# EasyEDA Pro project ProPrj_sensor_ultimate_2025-09-30.epro

# Schematic Schematic1
Board Name: Board1; Create Date: 2025-09-01; Page Name: P1; Project Name: sensor_ultimate; Schematic Name: Schematic1; Update Date: 2025-09-18; Company: EasyEDA.com; Page Size: A4; Version: V1.0
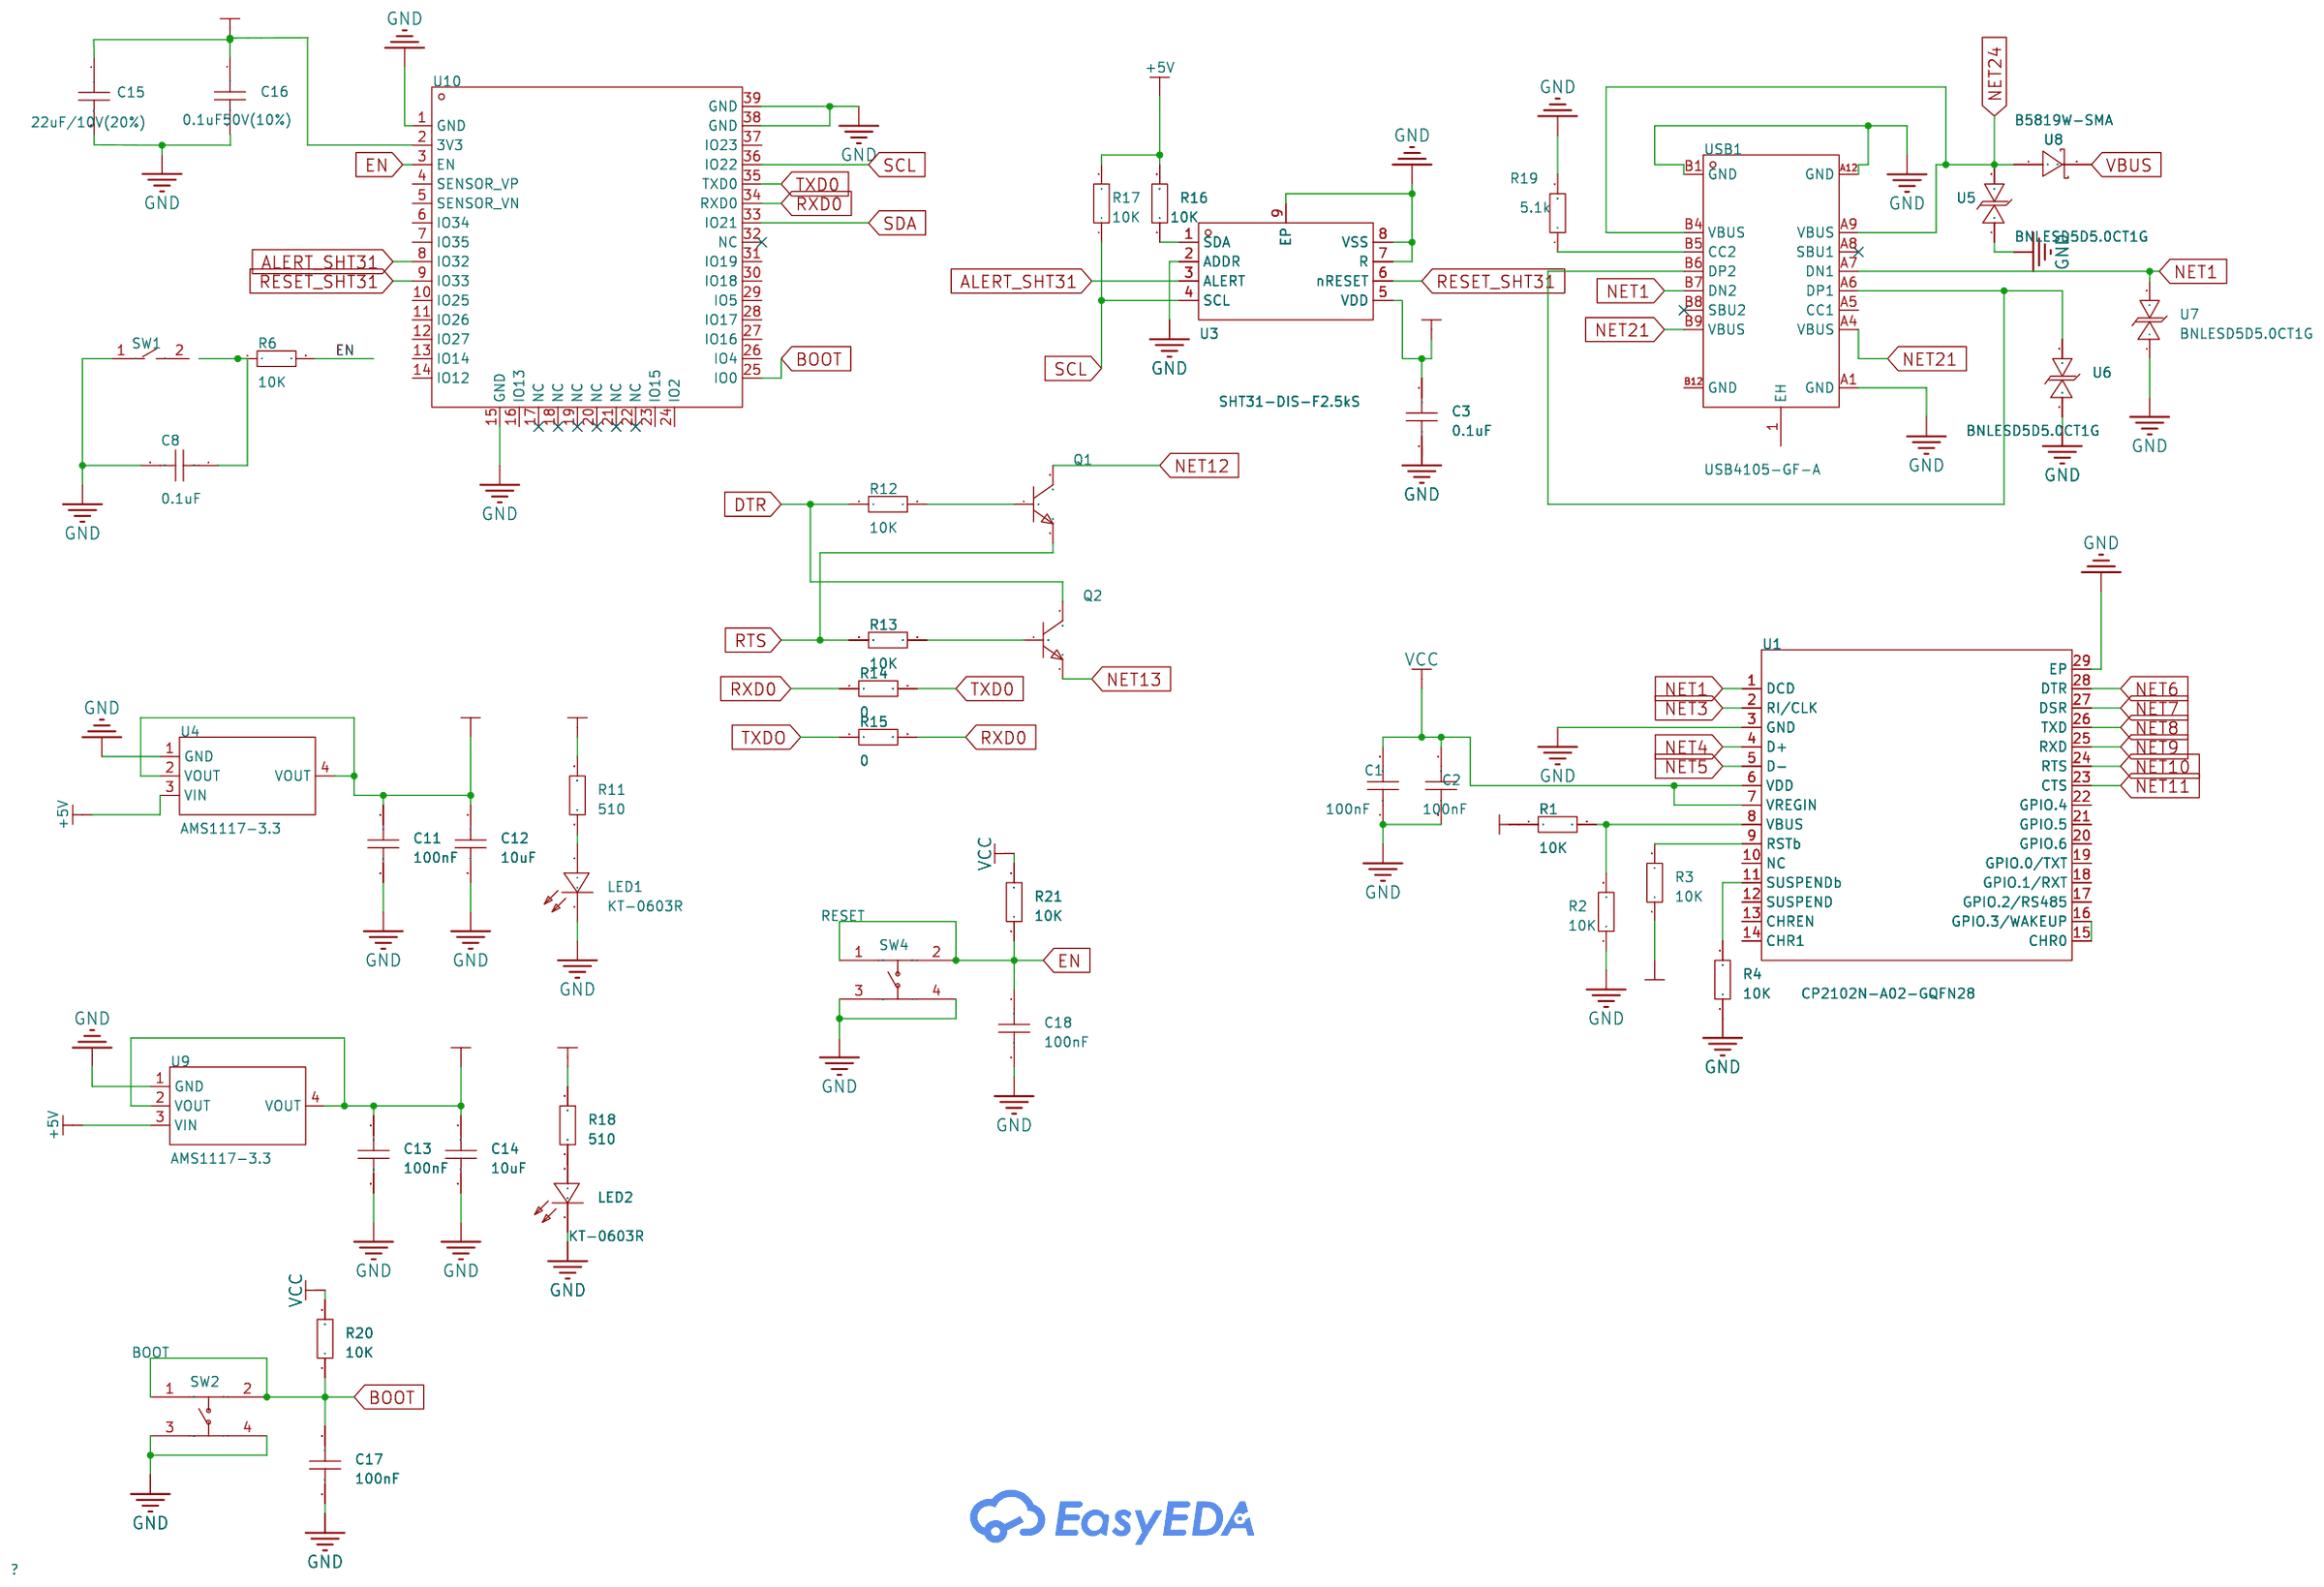
[diagram p0: schematic sheet]

## Parts
C1  100nF  [C0603]
C2  100nF  [C0603]
C3  0.1uF  [C0603]
C8  0.1uF  [C0201]
C11  100nF  [C0603]
C12  10uF  [C0603]
C13  100nF  [C0603]
C14  10uF  [C0603]
C15  22uF/10V(20%)  [C0201]
C16  0.1uF50V(10%)  [C0201]
C17  100nF  [C0603]
C18  100nF  [C0603]
LED1  KT-0603R  [LED0603-RD]
LED2  KT-0603R  [LED0603-RD]
Q1  -  [SOT-23_L2.9-W1.3-P1.90-LS2.4-BR]
Q2  -  [SOT-23_L2.9-W1.3-P1.90-LS2.4-BR]
R1  10K  [R0603]
R2  10K  [R0603]
R3  10K  [R0603]
R4  10K  [R0603]
R6  10K  [R0603]
R11  510  [R0603]
R12  10K  [R0603]
R13  10K  [R0603]
R14  0  [R0603]
R15  0  [R0603]
R16  10K  [R0603]
R17  10K  [R0603]
R18  510  [R0603]
R19  5.1k  [R0603]
R20  10K  [R0603]
R21  10K  [R0603]
SW1  TSE36331-025D343DF-R3000  [SW-SMD_L6.0-W3.7-TSE36331-025D343DF-R3000]
SW2  BOOT  [KEY-TH_4P-L6.0-W6.0-P4.50-LS6.5]
SW4  RESET  [KEY-TH_4P-L6.0-W6.0-P4.50-LS6.5]
U1  CP2102N-A02-GQFN28  [QFN-28_L5.0-W5.0-P0.50-TL-EP3.3]
U3  SHT31-DIS-F2.5kS  [DFN-8_L2.5-W2.5-P0.50-BL-EP]
U4  AMS1117-3.3  [SOT-223-3_L6.5-W3.4-P2.30-LS7.0-BR]
U5  BNLESD5D5.0CT1G  [SOD-523_L1.2-W0.8-LS1.6-BI]
U6  BNLESD5D5.0CT1G  [SOD-523_L1.2-W0.8-LS1.6-BI]
U7  BNLESD5D5.0CT1G  [SOD-523_L1.2-W0.8-LS1.6-BI]
U8  B5819W-SMA  [SOD-123_L2.7-W1.6-LS3.7-FD]
U9  AMS1117-3.3  [SOT-223-3_L6.5-W3.4-P2.30-LS7.0-BR]
U10  ESP32-WROOM-32E-H4  [WIFI-SMD_ESP32-WROOM-32E]
USB1  USB4105-GF-A  [TYPE-C-SMD_SBC-160S1A-20-S412]

## Library data of the parts
C1-C3 C11-C14 C17 C18 = CAP_0603: Supplier Footprint: 0603
C8 C15 C16 = CAP_0201: Supplier Footprint: 0201
LED1 LED2 = KT-0603R: Emitted Color:Red Power Dissipation:- Forward Current:- Dominant Wavelength:- Dominant Wavelength:- Peak Wavelength:- Diode Configuration:- Lens Color:- Color Temperature:- Color Temperature:- Viewing Angle:- Mounting Sytle:- Operating Temperature:-40℃~+8; LCSC Part Name: 0603 红灯 高亮; Supplier Part: C2286; Manufacturer: KENTO; Supplier Footprint: 0603; JLCPCB Part Class: Basic Part; Datasheet: https://atta.szlcsc.com/upload/public/pdf/source/20160616/1466072038404.pdf; Supplier: LCSC; Emitted Color: Red; Operating Temperature: -40℃~+85℃
Q1 Q2 = S8050_NPN: Supplier Footprint: SOT-23
R1-R4 R6 R11-R21 = Res_0603: Supplier Footprint: 0603
SW1 = TSE36331-025D343DF-R3000: LCSC Part Name: 3*6*2.5贴片防尘开关; Supplier Part: C48928354; Manufacturer: Khon(康宏电子); Supplier Footprint: SMD; JLCPCB Part Class: Extended Part; Datasheet: https://item.szlcsc.com/datasheet/TSE36331-025D343DF-R3000/51238608.html; Supplier: LCSC
SW2 SW4 = PTS645SH50-2LFS: Circuit:SPST Actuator Style:Round Button Operating Force:200gf Mounting Type:Direct Insert Length:6mm Width:6mm Switch Height:0.85mm Contact Current:50mA Voltage Rating:12V With Lamp:- Termination Style:PCPin Life:- Operating Temperature:-40℃~+85℃ Operati; LCSC Part Name: 6*6*0.85mm 直插 轻触开关; Supplier Part: C221868; Manufacturer: C&K; Supplier Footprint: 插件; JLCPCB Part Class: Extended Part; Datasheet: https://atta.szlcsc.com/upload/public/pdf/source/20190108/C285530_E89B379DE8DD14E424006A6061D0203A.pdf; Supplier: LCSC; Circuit: SPST; Actuator Style: Round Button; Operating Force: 200gf; Mounting Type: Direct Insert; Length: 6mm; Width: 6mm; Switch Height: 0.85mm; Contact Current: 50mA; Voltage Rating: 12V; Termination Style: PCPin; Operating Temperature: -40℃~+85℃
U1 = CP2102N-A02-GQFN28: Applications Function:USB to UART Protocol:- Voltage - Supply:3V~3.6V Voltage - Supply:3V~3.6V Operating Temperature:-40℃~+85℃@(Ta) Operating Temperature:-40℃~+85℃@(Ta); Supplier Part: C1550553; Manufacturer: SKYWORKS/SILICON LABS(芯科); Supplier Footprint: QFN-28-EP(5x5); JLCPCB Part Class: Extended Part; Datasheet: https://atta.szlcsc.com/upload/public/pdf/source/20201204/C964632_F2B790CC23A72455AEF523510305B30A.pdf; Supplier: LCSC; Applications Function: USB to UART; Voltage - Supply: 3V~3.6V; Operating Temperature: -40℃~+85℃@(Ta)
U3 = SHT31-DIS-F2.5kS: Supply Voltage:2.15V~5.5V Supply Voltage:2.15V~5.5V; LCSC Part Name: 1-101462-01; Supplier Part: C453460; Manufacturer: Sensirion(瑞士盛思锐); Supplier Footprint: DFN-8-EP(2.5x2.5); JLCPCB Part Class: Extended Part; Datasheet: https://atta.szlcsc.com/upload/public/pdf/source/20191108/C453460_03264038329C7E0127F8C91FAD7A185B.pdf; Supplier: LCSC; Supply Voltage: 2.15V~5.5V
U4 U9 = AMS1117-3.3_C6186: Output Type:Fixed Voltage - Supply:16V Output Voltage:3.3V Output Voltage:3.3V Output Current:1A Power Supply Rejection Ratio (PSRR):72dB@(120Hz) Voltage Dropout:1.1V@(800mA) standby current:5mA Noise:- Features:Over Current Protection；Over Temperature Pr; LCSC Part Name: 输出3.3V 1A; Supplier Part: C6186; Manufacturer: AMS; Supplier Footprint: SOT-223; JLCPCB Part Class: Basic Part; Datasheet: https://item.szlcsc.com/datasheet/AMS1117-3.3/6652.html; Supplier: LCSC; Output Type: Fixed; Voltage - Supply: 16V; Output Voltage: 3.3V; Output Current: 1A; Power Supply Rejection Ratio (PSRR): 72dB@(120Hz); Voltage Dropout: 1.1V@(800mA); standby current: 5mA; Features: Over Current Protection；Over Temperature Protection; Operating Temperature: -40℃~+125℃; Output Configuration: Positive; Number of Outputs: 1
U5-U7 = BNLESD5D5.0CT1G: Polarity:Bidirectional Reverse Stand-Off Voltage (Vrwm):5V Clamping Voltage:15V Peak Pulse Current (Ipp):8A@8/20us Peak Pulse Power Dissipation (Ppp):120W@8/20us Voltage - Breakdown:9.5V Reverse Leakage Current (Ir):500nA Number of Channels:1.0 level of p; Supplier Part: C20416613; Manufacturer: BORN(伯恩半导体); Supplier Footprint: SOD-523; JLCPCB Part Class: Extended Part; Datasheet: https://item.szlcsc.com/datasheet/BNLESD5D5.0CT1G/21749714.html; Supplier: LCSC; Polarity: Bidirectional; Reverse Stand-Off Voltage (Vrwm): 5V; Clamping Voltage: 15V; Peak Pulse Current (Ipp): 8A@8/20us; Peak Pulse Power Dissipation (Ppp): 120W@8/20us; Voltage - Breakdown: 9.5V; Reverse Leakage Current (Ir): 500nA; Number of Channels: 1.0; level of protection: IEC 61000-4-4；IEC 61000-4-5；IEC 61000-4-2; Type: ESD; Junction Capacitance: 18pF
U8 = B5819W-SMA: Supplier Part: C9900009049; Supplier Footprint: SMA; JLCPCB Part Class: Extended Part; Supplier: LCSC
U10 = ESP32-WROOM-32E-H4: LCSC Part Name: 命名更改，4MB即H4，为尾缀，模组丝印更改为H4，H为高温105°C，软硬件无更改 ESP32-WROOM-32E-H4; Supplier Part: C3013935; Manufacturer: ESPRESSIF(乐鑫); Supplier Footprint: SMD,18x25.5mm; JLCPCB Part Class: Extended Part; Datasheet: https://atta.szlcsc.com/upload/public/pdf/source/20241030/447B1C85FFE3FB0A37F75624F2C6635F.pdf; Supplier: LCSC
USB1 = USB4105-GF-A: Supplier Part: C3020560; Manufacturer: GCT; Supplier Footprint: SMD; JLCPCB Part Class: Extended Part; Datasheet: https://atta.szlcsc.com/upload/public/pdf/source/20220520/320CE7E4F2C5E8A05ADD2DAC45B818D3.pdf; Supplier: LCSC

## Nets
3V3: C3.1 C15.1 C16.1 R3.1 R11.2 R18.2 U3.5(VDD)
+3V: C11.1 C12.1 C13.1 C14.1 U4.2(VOUT) U4.4(VOUT) U9.2(VOUT) U9.4(VOUT)
+5V: R16.2 R17.2 U4.3(VIN) U9.3(VIN)
GND: C1.1 C2.2 C3.2 C8.2 C11.2 C12.2 C13.2 C14.2 C15.2 C17.2 C18.2 LED1.1(K) LED2.1(K) R2.1 R4.1 R19.2 SW1.1 SW2.3 SW2.4 SW4.3 SW4.4 U1.3(GND) U1.29(EP) U3.2(ADDR) U3.7(R) U3.8(VSS) U3.9(EP) U4.1(GND) U5.1 U6.1 U7.1 U9.1(GND) U10.1(GND) U10.15(GND) U10.38(GND) U10.39(GND) USB1.A1(GND) USB1.A12(GND) USB1.B1(GND)
VBUS: U8.2(K)
VCC: C1.2 C2.1 R20.2 R21.2 U1.6(VDD) U1.7(VREGIN)
ALERT_SHT31: U3.3(ALERT) U10.8(IO32)
BOOT: C17.1 R20.1 SW2.1 SW2.2 U10.25(IO0)
DTR: Q2.3(C) R12.1
EN: C18.1 R6.2 R21.1 SW4.1 SW4.2 U10.3(EN)
NET1: U1.1(DCD) U7.2 USB1.A7(DN1) USB1.B7(DN2)
NET3: U1.2(RI/CLK)
NET4: U1.4(D+)
NET5: U1.5(D-)
NET6: U1.28(DTR)
NET7: U1.27(DSR)
NET8: U1.26(TXD)
NET9: U1.25(RXD)
NET10: U1.24(RTS)
NET11: U1.23(CTS)
NET12: Q1.3(C)
NET13: Q2.2(E)
NET21: USB1.A4(VBUS) USB1.B9(VBUS)
NET24: U5.2 U8.1(A) USB1.A9(VBUS) USB1.B4(VBUS)
RESET_SHT31: U3.6(nRESET) U10.9(IO33)
RTS: Q1.2(E) R13.1
RXD0: R14.1 R15.2 U10.34(RXD0)
SCL: R17.1 U3.4(SCL) U10.36(IO22)
SDA: U10.33(IO21)
TXD0: R14.2 U10.35(TXD0)
TXDO: R15.1
V_BUS: R1.1
$1N483: C8.1 R6.1
$1N713: R16.1 U3.1(SDA)
$1N2024: Q1.1(B) R12.2
$1N2026: Q2.1(B) R13.2
$1N2294: LED2.2(A) R18.1
$1N3424: U1.15(CHR0) U1.16(GPIO.3/WAKEUP)
$1N3429: R1.2 R2.2 U1.8(VBUS)
$1N3437: R3.2 U1.9(RSTb)
$1N3438: R4.2 U1.11(SUSPENDb)
$1N3711: LED1.2(A) R11.1
$1N5853: U6.2 USB1.A6(DP1) USB1.B6(DP2)
$1N5989: R19.1 USB1.B5(CC2)

Not connected (* = marked no-connect by the designer): C16 2; SW1 2; U1 10(NC) 12(SUSPEND) 13(CHREN) 14(CHR1) 17(GPIO.2/RS485) 18(GPIO.1/RXT) 19(GPIO.0/TXT) 20(GPIO.6) 21(GPIO.5) 22(GPIO.4); U10 2(3V3) 4(SENSOR_VP) 5(SENSOR_VN) 6(IO34) 7(IO35) 10(IO25) 11(IO26) 12(IO27) 13(IO14) 14(IO12) 16(IO13) 17(NC)* 18(NC)* 19(NC)* 20(NC)* 21(NC)* 22(NC)* 23(IO15) 24(IO2) 26(IO4) 27(IO16) 28(IO17) 29(IO5) 30(IO18) 31(IO19) 32(NC)* 37(IO23); USB1 1(EH) A5(CC1) A8(SBU1)* B8(SBU2)* B12(GND)

# Board PCB1
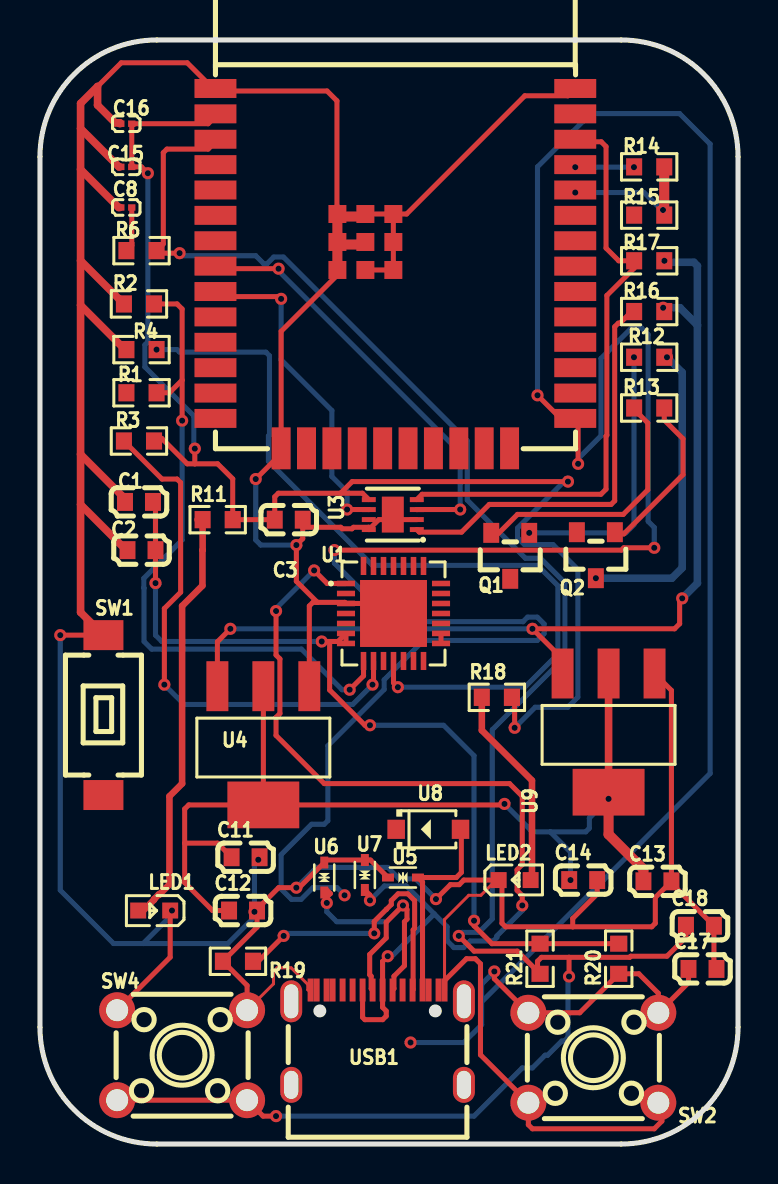
[diagram p1: board, top side]
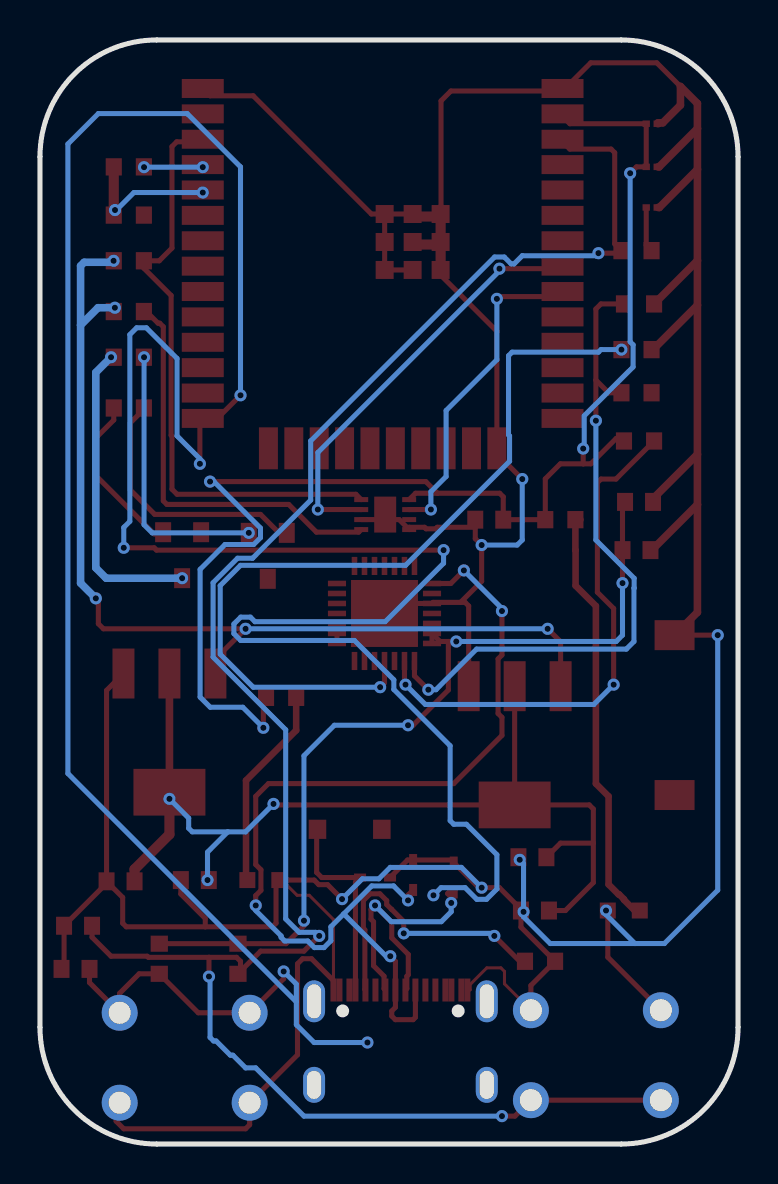
[diagram p2: board, bottom side, seen from below]

Outline 34.93 x 55.25 mm; copper layers: Top Layer, Bottom Layer. Coordinates in mm from the lower left corner of the outline.
Outline path: 0,49.4 0,5.84 arc(1.71,1.71) 5.84,0 29.08,0 arc(33.21,1.71) 34.93,5.84 34.93,49.4 arc(33.21,53.53) 29.08,55.25 5.84,55.25 arc(1.71,53.53) 0,49.4
Stack: Top Layer 0.035mm / Dielectric1 1.51mm FR4 er 4.5 / Bottom Layer 0.035mm

## Design rules (mm)
template: JLCPCB Capability(Two Layers Board)
spacing copperThickness1oz (default): track to track 0.102, other pairs 0.152 to 0.3
spacing copperThickness2oz: track to track 0.203, other pairs 0.152 to 0.3
track width copperThickness1oz (default): min 0.127, default 0.254, max 2.54
track width copperThickness2oz: min 0.203, default 0.254, max 2.54
differential pair differentialPair (default): width min 0.127, default 0.254, max 2.54; gap min 0.152, default 0.152
via viaSize (default): diameter min 0.5, default 0.61, max 10; hole min 0.3, default 0.305, max 6.3

## Placement (name value [footprint] x y rotation side)
C1  100nF  [C0603]  4.95 32.13 0 top
C2  100nF  [C0603]  5.08 29.72 180 top
C3  0.1uF  [C0603]  12.45 31.24 0 top
C8  0.1uF  [C0201]  4.32 46.86 180 top
C11  100nF  [C0603]  10.29 14.35 0 top
C12  10uF  [C0603]  10.16 11.68 0 top
C13  100nF  [C0603]  30.89 13.15 0 top
C14  10uF  [C0603]  27.18 13.21 0 top
C15  22uF/10V(20%)  [C0201]  4.32 48.9 180 top
C16  0.1uF50V(10%)  [C0201]  4.32 51.05 180 top
C17  100nF  [C0603]  33.15 8.76 0 top
C18  100nF  [C0603]  33.02 10.92 0 top
LED1  KT-0603R  [LED0603-RD]  5.72 11.68 180 top
LED2  KT-0603R  [LED0603-RD]  23.75 13.21 0 top
Q1  -  [SOT-23_L2.9-W1.3-P1.90-LS2.4-BR]  23.53 29.43 90 top
Q2  -  [SOT-23_L2.9-W1.3-P1.90-LS2.4-BR]  27.81 29.46 90 top
R1  10K  [R0603]  5.08 37.59 0 top
R2  10K  [R0603]  4.95 42.04 0 top
R3  10K  [R0603]  4.95 35.18 180 top
R4  10K  [R0603]  5.08 39.75 0 top
R6  10K  [R0603]  5.08 44.7 0 top
R11  510  [R0603]  8.89 31.24 0 top
R12  10K  [R0603]  30.48 39.37 180 top
R13  10K  [R0603]  30.48 36.83 0 top
R14  0  [R0603]  30.48 48.9 180 top
R15  0  [R0603]  30.48 46.48 0 top
R16  10K  [R0603]  30.48 41.66 0 top
R17  10K  [R0603]  30.48 44.2 0 top
R18  510  [R0603]  22.86 22.35 0 top
R19  5.1k  [R0603]  9.91 9.14 180 top
R20  10K  [R0603]  28.96 9.27 90 top
R21  10K  [R0603]  25.02 9.27 90 top
SW1  TSE36331-025D343DF-R3000  [SW-SMD_L6.0-W3.7-TSE36331-025D343DF-R3000]  3.18 21.46 270 top
SW2  BOOT  [KEY-TH_4P-L6.0-W6.0-P4.50-LS6.5]  27.69 4.32 180 top
SW4  RESET  [KEY-TH_4P-L6.0-W6.0-P4.50-LS6.5]  7.11 4.44 0 top
U1  CP2102N-A02-GQFN28  [QFN-28_L5.0-W5.0-P0.50-TL-EP3.3]  17.69 26.55 0 top
U3  SHT31-DIS-F2.5kS  [DFN-8_L2.5-W2.5-P0.50-BL-EP]  17.65 31.5 90 top
U4  AMS1117-3.3  [SOT-223-3_L6.5-W3.4-P2.30-LS7.0-BR]  11.18 19.94 90 top
U5  BNLESD5D5.0CT1G  [SOD-523_L1.2-W0.8-LS1.6-BI]  18.16 13.34 0 top
U6  BNLESD5D5.0CT1G  [SOD-523_L1.2-W0.8-LS1.6-BI]  14.22 13.34 270 top
U7  BNLESD5D5.0CT1G  [SOD-523_L1.2-W0.8-LS1.6-BI]  16.26 13.46 270 top
U8  B5819W-SMA  [SOD-123_L2.7-W1.6-LS3.7-FD]  19.43 15.75 180 top
U9  AMS1117-3.3  [SOT-223-3_L6.5-W3.4-P2.30-LS7.0-BR]  28.45 20.57 90 top
U10  ESP32-WROOM-32E-H4  [WIFI-SMD_ESP32-WROOM-32E]  17.78 43.82 270 top
USB1  USB4105-GF-A  [TYPE-C-SMD_SBC-160S1A-20-S412]  16.89 5.33 0 top

## Footprints (pads in the part's own frame, mm; a bottom-side part is the same pattern mirrored in y, then rotated)
C0201
  rect 0.368x0.324 smd: 1(-0.275,0) 2(0.275,0)
C0603
  rect 0.8x0.9 smd: 1(-0.7,0) 2(0.7,0)
DFN-8_L2.5-W2.5-P0.50-BL-EP
  rect 0.25x0.7 smd: 1(-0.75,-1.2) 2(-0.25,-1.2) 3(0.25,-1.2) 4(0.75,-1.2) 5(0.75,1.2) 6(0.25,1.2) 7(-0.25,1.2) 8(-0.75,1.2)
  rect 1.8x1.1 smd: 9(0,0)
KEY-TH_4P-L6.0-W6.0-P4.50-LS6.5
  round 1.8 hole 1.1: 1(-3.251,-2.251) 2(3.251,-2.251) 3(3.251,2.251) 4(-3.251,2.251)
LED0603-RD
  rect 0.8x0.8 smd: 1(-0.799,0) 2(0.799,0)
QFN-28_L5.0-W5.0-P0.50-TL-EP3.3
  rect 0.905x0.28 smd: 1(-2.377,1.5) 2(-2.377,1) 3(-2.377,0.5) 4(-2.377,0) 5(-2.377,-0.5) 6(-2.377,-1) 7(-2.377,-1.5) 15(2.377,-1.5) 16(2.377,-1) 17(2.377,-0.5) 18(2.377,0) 19(2.377,0.5) 20(2.377,1) 21(2.377,1.5)
  rect 0.28x0.905 smd: 8(-1.5,-2.377) 9(-1,-2.377) 10(-0.5,-2.377) 11(0,-2.377) 12(0.5,-2.377) 13(1,-2.377) 14(1.5,-2.377) 22(1.5,2.377) 23(1,2.377) 24(0.5,2.377) 25(0,2.377) 26(-0.5,2.377) 27(-1,2.377) 28(-1.5,2.377)
  rect 3.35x3.35 smd: 29(0,0)
R0603
  rect 0.806x0.864 smd: 1(-0.753,0) 2(0.753,0)
SOD-123_L2.7-W1.6-LS3.7-FD
  rect 0.88x0.96 smd: 1(-1.61,0) 2(1.61,0)
SOD-523_L1.2-W0.8-LS1.6-BI
  rect 0.6x0.4 smd: 1(-0.75,0) 2(0.75,0)
SOT-23_L2.9-W1.3-P1.90-LS2.4-BR
  rect 1x0.8 smd: 1(1.15,-0.95) 2(1.15,0.95) 3(-1.15,0)
SOT-223-3_L6.5-W3.4-P2.30-LS7.0-BR
  rect 2.5x1.1 smd: 1(2.97,-2.3) 2(2.97,0) 3(2.97,2.3)
  rect 2.34x3.6 smd: 4(-2.97,0)
SW-SMD_L6.0-W3.7-TSE36331-025D343DF-R3000
  rect 1.5x2 smd: 1(-4,0) 2(4,0)
TYPE-C-SMD_SBC-160S1A-20-S412
  oval 1.1x2.1 hole 0.7x1.7: 1(-4.32,1.807) 1(4.32,1.807)
  oval 1.1x1.8 hole 0.7x1.4: 1(-4.32,-2.373) 1(4.32,-2.373)
  rect 0.3x1.15 smd: A1(-3.35,2.372) A4(-2.55,2.372) A5(-1.25,2.372) A6(-0.25,2.372) A7(0.25,2.372) A8(1.25,2.373) A9(2.55,2.373) A12(3.35,2.372) B1(3.05,2.372) B4(2.25,2.373) B5(1.75,2.372) B6(0.75,2.372) B7(-0.75,2.372) B8(-1.75,2.373) B9(-2.25,2.372) B12(-3.05,2.372)
WIFI-SMD_ESP32-WROOM-32E
  rect 0.95x2.1 smd: 1(-9.002,-9) 2(-7.732,-9) 3(-6.463,-9) 4(-5.192,-9) 5(-3.922,-9) 6(-2.652,-9) 7(-1.383,-9) 8(-0.113,-9) 9(1.157,-9) 10(2.428,-9) 11(3.697,-9) 12(4.968,-9) 13(6.237,-9) 14(7.508,-9) 25(7.508,9) 26(6.237,9) 27(4.968,9) 28(3.697,9) 29(2.428,9) 30(1.157,9) 31(-0.113,9) 32(-1.383,9) 33(-2.652,9) 34(-3.922,9) 35(-5.192,9) 36(-6.463,9) 37(-7.732,9) 38(-9.002,9)
  rect 2.1x0.95 smd: 15(9.002,-5.715) 16(9.002,-4.445) 17(9.002,-3.175) 18(9.002,-1.905) 19(9.002,-0.635) 20(9.002,0.635) 21(9.002,1.905) 22(9.002,3.175) 23(9.002,4.445) 24(9.002,5.715)
  rect 0.9x0.9 smd: 39(-2.721,-0.1) 39(-2.721,-1.5) 39(-2.721,-2.9) 39(-1.321,-0.1) 39(-1.321,-1.5) 39(-1.321,-2.9) 39(0.079,-0.1) 39(0.079,-1.5) 39(0.079,-2.9)

## Nets
As in the schematic, except:
3V3: C3.1 C15.1 C16.1 R3.1 R11.2 R18.2 U3.5 U10.2
GND: C1.1 C2.2 C3.2 C8.2 C11.2 C12.2 C13.2 C14.2 C15.2 C16.2 C17.2 C18.2 LED1.1 LED2.1 R2.1 R4.1 R19.2 SW1.1 SW2.3 SW2.4 SW4.3 SW4.4 U1.3 U1.29 U3.2 U3.7 U3.8 U3.9 U4.1 U5.1 U6.1 U7.1 U9.1 U10.1 U10.15 U10.38 U10.39 USB1.A1 USB1.A12 USB1.B1

Pads without a net: SW1 2; U1 10 12 13 14 17 18 19 20 21 22; U10 4 5 6 7 10 11 12 13 14 16 17 18 19 20 21 22 23 24 26 27 28 29 30 31 32 37; USB1 1 A5 A8 B8 B12

## Via types
v1: diameter 0.61, hole 0.305, Top Layer to Bottom Layer, 62 vias

## Routing (per net, layer and track width the routed paths; a pad name or vN(x,y) marks a point on that pad's centre or on a via; arc(x,y) is an arc through that point)
3V3: length 69
  Top Layer w0.254: 7.74,34.04 8.89,34.04 9.64,33.28 9.64,31.37 ; 7.74,34.04 7.75,34.04 v1(7.75,34.8) ; 7.74,34.04 7.37,34.04 6.1,35.31 5.71,35.31 ; U3.5 16.13,32.56 15.04,32.56 ; v1(5.4,48.58) 5.08,48.9 C15.1 C16.1 8.41,51.05 8.78,51.42 ; v1(23.75,20.83) 23.75,22.22 R18.2 ; 15.04,32.56 15.62,33.15 v1(26.42,33.15) ; 15.04,32.56 11.93,32.56 11.75,32.39 C3.1 R11.2
  Bottom Layer w0.254: v1(7.75,34.8) 7.7,34.85 7.7,36.44 5.25,38.88 5.25,39.99 5.4,40.14 v1(5.4,48.58) ; v1(26.42,33.15) 26.22,33.15 23.89,30.82 23.89,30.34 24.24,30 25.67,30 26.91,28.75 26.91,22.36 26.41,21.86 24.78,21.86 v1(23.75,20.83)
+3V: length 51.9
  Top Layer w0.254: C11.1 8.88,15.06 7.24,15.06 ; U4.2 U4.4 ; U4.4 23.19,16.97 v1(23.24,17.02) ; U4.4 7.44,16.97 7.24,16.76 7.24,15.06 ; C12.1 8.64,11.68 7.24,13.08 7.24,15.06
  Top Layer w0.381: U9.4 U9.2
  Top Layer w0.508: C13.1 30.19,13.75 28.45,15.49 v1(28.45,17.27) U9.4
  Bottom Layer w0.254: v1(28.45,17.27) 27.48,16.31 27.48,15.8 27.31,15.62 25.53,15.62 ; 25.53,15.62 24.64,15.62 v1(23.24,17.02) ; 25.53,15.62 26.54,14.6 v1(26.54,13.21)
+5V: length 50.9
  Top Layer w0.254: U9.3 26.15,24.27 v1(24.64,25.78) 31.75,25.78 32,26.04 32,27.18 v1(32.13,27.31) ; R16.2 31.23,41.79 v1(31.18,41.85) ; v1(9.53,25.78) 8.88,25.13 8.88,22.91
  Bottom Layer w0.254: v1(9.53,25.78) v1(24.64,25.78)
  Bottom Layer w0.381: 32.89,40.97 32.89,43.94 32.71,44.12 31.32,44.12 v1(31.24,44.2) ; 32.89,40.97 32.02,41.85 v1(31.18,41.85) ; 32.89,40.97 32.89,28.07 v1(32.13,27.31)
GND: length 252.6
  Top Layer w0.152: SW4.3 11.68,8.02 11.68,8.64 11.86,8.82 12.57,8.82 13.4,7.98 13.4,7.72 13.41,7.71 ; 22.7,13.08 22.06,12.45 21.45,12.45 20.24,11.23 20.24,8.18
  Top Layer w0.254: 13.88,27.1 12.83,28.16 v1(12.83,29.97) 13.15,30.29 13.15,30.86 ; 13.88,27.1 15.25,27.1 U1.3 17.19,27.05 U1.29 ; 13.88,27.1 13.66,27.1 13.48,26.92 U4.1 ; U3.2 16.95,31.25 U3.8 ; 2.88,52.92 4.06,54.1 7.37,54.1 8.78,52.69 14.37,52.69 14.86,52.2 14.86,46.94 14.88,46.92 14.88,46.41 ; C14.2 27.88,12.51 26.65,11.29 26.65,10.87 ; 23.11,13.04 23.11,11.05 23.29,10.87 26.65,10.87 ; 26.65,10.87 30.61,10.87 30.79,11.05 30.79,12.34 C13.2 31.59,22.7 U9.1 ; U10.39 U10.39 U10.39 U10.39 ; U10.39 18.34,46.54 24.26,52.45 26.41,52.45 U10.38 ; U10.39 U10.39 ; USB1.A12 20.24,8.18 21.34,9.27 21.79,9.27 22.04,9.02 22.04,4.46 SW2.3 24.44,0.97 24.64,0.76 30.73,0.76 31.12,1.14 31.12,1.89 SW2.4 ; C12.2 10.86,10.85 R19.2 10.36,7.93 SW4.3 ; 31.59,13.05 C18.2 33.72,8.89 C17.2 ; 13.15,30.86 15.05,30.86 15.12,30.79 15.61,30.79 15.69,30.86 16.45,30.86 16.45,30.87 ; 13.15,30.86 C3.2 ; SW4.4 6.51,9.35 LED1.1 ; v1(19.81,12.26) 20.54,12.98 20.98,12.98 21.2,13.21 LED2.1 ; v1(10.79,33.27) 12.06,34.54 12.06,40.67 14.88,43.48 ; 14.35,14.21 U7.1 16.53,14.21 U5.1 ; SW1.1 v1(1.02,25.46) ; U6.1 12.97,12.83 v1(12.83,12.83) 11.94,12.83 v1(10.73,11.62)
  Top Layer w0.381: 2.03,50.81 3.95,48.9 4,48.9 ; 2.03,50.81 2.03,52.07 2.88,52.92 2.88,51.98 3.77,51.1 4,51.1 4,51.05 ; 2.03,50.81 2.03,48.77 ; 2.03,41.97 4.25,39.75 R4.1 ; 2.03,41.97 2.03,34.51 ; 2.03,41.97 2.03,44.2 ; 2.03,32 4.31,29.72 C2.2 ; 2.03,32 2.03,26.61 SW1.1 ; 2.03,32 2.03,34.51 ; 4,46.86 3.94,46.86 2.03,48.77 ; 2.03,48.77 2.03,44.2 ; 2.03,34.51 4.25,32.29 C1.1 ; 2.03,44.2 R2.1
  Top Layer w0.508: 14.88,45.01 16.28,45.01 ; 14.88,45.01 14.88,46.41 16.28,46.41 ; 14.88,45.01 U10.39
  Bottom Layer w0.254: v1(19.81,12.26) 18.8,13.27 17.97,13.27 17.4,13.84 13.84,13.84 v1(12.83,12.83) ; 5.16,10.03 6.6,11.48 v1(6.6,11.68) ; 5.16,10.03 9.4,10.03 10.73,11.37 v1(10.73,11.62) 10.73,14.03 v1(10.92,14.22) ; 5.16,10.03 3.68,10.03 1.02,12.7 v1(1.02,25.46) ; v1(12.83,29.97) 11.05,29.97 10.79,30.23 v1(10.79,33.27)
VCC: length 44.2
  Top Layer w0.254: v1(21.72,11.18) 21.72,10.92 22.61,10.02 R21.2 28.57,10.02 28.83,10.28 ; U1.7 U1.6 14.91,25.15 14.49,25.15 ; v1(14.1,25.15) 14.49,25.15 ; 14.49,25.15 14.49,22.72 16.26,20.96 v1(16.51,20.96) ; v1(5.78,28.07) 5.78,32 C1.2
  Bottom Layer w0.254: v1(14.1,25.15) 6.1,25.15 5.78,25.46 v1(5.78,28.07) ; v1(21.72,11.18) 21.72,19.43 20.19,20.96 v1(16.51,20.96)
ALERT_SHT31: length 21.1
  Top Layer w0.254: v1(21.02,31.75) 18.86,31.75 U3.3 ; 8.78,43.8 v1(11.94,43.8)
  Bottom Layer w0.254: v1(21.02,31.75) 21.02,34.6 11.94,43.69 v1(11.94,43.8)
BOOT: length 169.8
  Top Layer w0.254: v1(26.92,34.04) 26.92,36.16 U10.25 26.05,36.31 v1(24.89,37.47) ; C17.1 32.45,8.08 SW2.1 30.94,7.54 29.96,8.52 R20.1 27.01,6.57 SW2.2 22.73,8.27 v1(22.73,8.64) ; v1(14.73,29.72) 29.09,29.72 29.21,29.84 v1(30.73,29.84)
  Bottom Layer w0.254: v1(18.54,5.08) 21.21,5.08 22.1,5.97 22.1,7.11 ; 22.1,7.11 33.53,18.54 33.53,50.04 32,51.56 27.56,51.56 24.89,48.9 v1(24.89,37.47) ; 22.1,7.11 22.1,8 v1(22.73,8.64) ; v1(15.24,12.45) 14.86,12.83 13.65,12.83 13.07,12.24 12.59,12.24 12.06,12.76 12.06,14.48 13.59,16 14.22,16 14.4,16.18 14.4,19.93 17.22,22.75 17.22,23.23 19.19,25.2 24.88,25.2 25.22,25.54 25.22,26.02 24.88,26.37 24.4,26.37 24.17,26.14 17.66,26.14 14.73,29.06 v1(14.73,29.72) ; v1(30.73,29.84) 30.73,30.85 30.43,31.16 30.43,40.5 30.09,40.84 29.6,40.84 28.07,39.31 28.07,35.43 26.92,34.29 v1(26.92,34.04)
DTR: length 15.4
  Bottom Layer w0.381: v1(31.37,39.37) 32.13,38.61 32.13,28.83 31.62,28.31 v1(27.81,28.31)
EN: length 100
  Top Layer w0.254: v1(6.98,44.58) 5.96,44.58 R6.2 6.17,45.04 6.17,49.6 6.35,49.78 8.41,49.78 8.78,50.15 ; v1(20.95,10.41) 21.72,9.65 23.88,9.65 24.89,8.64 ; 26.47,9.34 v1(26.47,8.38) ; 26.47,9.34 25.09,9.34 24.89,9.14 24.89,8.64 ; 26.47,9.34 29.5,9.34 29.56,9.4 31.37,9.4 32.32,10.35 C18.1 ; 24.89,8.64 R21.1 ; v1(11.81,1.4) 11.16,1.4 SW4.2 SW4.1
  Bottom Layer w0.254: v1(20.95,10.41) 21.13,10.59 21.96,10.59 22.63,11.26 22.63,20.73 26.26,24.36 26.26,28.09 25.04,29.31 24.29,29.31 21.38,32.22 21.38,35.18 12.18,44.38 11.7,44.38 11.35,44.04 11.2,44.04 10.79,44.45 7.11,44.45 v1(6.98,44.58) ; v1(11.81,1.4) 21.72,1.4 24.13,3.81 24.64,3.81 25.27,4.44 25.4,4.44 26.11,5.15 26.24,5.15 26.42,5.33 26.42,8.33 v1(26.47,8.38)
NET1: length 50.7
  Top Layer w0.254: v1(11.81,26.67) 11.81,24.47 12,24.27 12,21.54 11.81,21.35 11.81,20.45 14.22,18.03 23.5,18.03 24.13,17.4 24.13,13.98 23.87,13.72 23.87,12.69 24.13,12.43 v1(24.13,11.94) ; v1(16.51,12.19) 16.51,12.46 U7.2 ; USB1.B7 16.14,6.34 16.26,6.22 17.15,6.22 17.32,6.4 17.32,6.66 17.14,6.84 USB1.A7 17.14,9.14 v1(17.4,9.4) ; v1(13.72,28.7) 14.37,28.05 U1.1
  Bottom Layer w0.254: v1(16.51,12.19) 17.23,12.92 18.33,12.92 19.73,11.52 ; 19.73,11.52 20.37,10.87 20.37,10.17 20.71,9.83 21.2,9.83 21.53,10.16 22.68,10.16 22.86,10.34 22.86,10.41 24.13,11.68 v1(24.13,11.94) ; 19.73,11.52 17.61,9.4 v1(17.4,9.4) ; v1(13.72,28.7) 11.81,26.8 v1(11.81,26.67)
NET24: length 10.2
  Top Layer w0.254: USB1.B4 19.14,13.11 U5.2 20.83,13.34 21.08,13.59 21.08,15.71 U8.1
RESET_SHT31: length 16.3
  Top Layer w0.254: v1(12.06,42.29) 11.95,42.4 8.78,42.4 ; U3.6 16.45,31.75 v1(15.37,31.75)
  Bottom Layer w0.254: v1(15.37,31.75) 15.37,32.64 14.6,33.4 14.6,36.7 12.06,39.24 v1(12.06,42.29)
RTS: length 13.1
  Top Layer w0.254: R13.1 29.73,36.76 30.41,36.08 30.41,32.73 29.18,31.51 23.89,31.51 22.95,30.57 22.59,30.57 Q1.2
RXD0: length 7.2
  Top Layer w0.508: R14.1 R15.2
  Bottom Layer w0.254: v1(31.17,46.74) 31.1,46.74 30.23,47.61 v1(26.78,47.61)
SCL: length 30.1
  Top Layer w0.254: U3.4 19.12,32.51 28.07,32.51 28.32,32.77 28.32,35.42 28.36,35.46 28.36,42.46 29.73,43.82 R17.1 28.96,44.2 28.32,44.83 28.32,49.91 28.08,50.15 26.78,50.15
TXD0: length 2.9
  Bottom Layer w0.254: v1(26.78,48.88) v1(29.72,48.88)
$1N483: length 2.3
  Top Layer w0.254: C8.1 4.59,44.97 R6.1
$1N713: length 20.6
  Top Layer w0.254: R16.1 29.6,41.66 29.02,41.07 28.93,41.07 28.75,40.89 28.75,32.18 28.57,32 22.48,32 21.09,30.62 18.98,30.62 U3.1
$1N2024: length 13.8
  Bottom Layer w0.254: v1(29.72,39.37) 29.72,30.99 29.31,30.58 v1(24.48,30.58)
$1N2026: length 8.4
  Top Layer w0.254: R13.2 31.23,36.23 32.18,35.29 32.18,33.49 29.21,30.53 28.85,30.53 Q2.1
$1N2294: length 10
  Top Layer w0.33: 22.11,22.1 22.11,20.7 24.62,18.19 24.62,13.28 LED2.2
$1N3424: length 0.5
  Top Layer w0.254: U1.16 U1.15
$1N3429: length 33.5
  Top Layer w0.254: v1(15.49,22.73) 16.19,23.43 U1.8 ; R1.2 6.48,37.59 7.11,38.23 ; 7.11,38.23 v1(7.11,36.2) ; 7.11,38.23 7.11,41.78 6.86,42.04 R2.2
  Bottom Layer w0.254: v1(7.11,36.2) 7.11,30.23 5.2,28.31 5.2,27.83 5.21,27.81 5.21,25.15 5.59,24.77 13.08,24.77 15.11,22.73 v1(15.49,22.73)
$1N3437: length 26.6
  Top Layer w0.254: v1(16.64,22.99) 16.69,23.04 U1.9 ; R3.2 6.1,33.27 6.86,33.27 7.04,33.09 7.04,27.61 6.22,26.8 v1(6.22,22.99)
  Bottom Layer w0.254: v1(6.22,22.99) 7.22,21.99 15.64,21.99 v1(16.64,22.99)
$1N3438: length 41.6
  Top Layer w0.254: v1(17.91,22.86) 17.69,23.08 U1.11
  Bottom Layer w0.254: v1(17.91,22.86) 24.26,22.86 25.91,24.51 25.91,27.94 24.89,28.96 16.64,28.96 11.43,34.16 11.43,35.43 11.48,35.49 11.48,39.44 11.3,39.62 6.98,39.62 6.86,39.75 v1(5.83,39.75)
$1N3711: length 21.2
  Top Layer w0.33: LED1.2 5.17,11.68 5.71,12.22 5.71,12.25 5.95,12.49 5.98,12.49 6.48,12.99 6.48,17.4 7.11,18.03 7.11,26.92 8.13,27.94 8.13,29.71 8.14,29.72 8.14,30.99 7.88,31.24
$1N5853: length 15.2
  Top Layer w0.254: USB1.B6 17.71,7.78 17.71,8.4 18.24,8.92 18.24,11.12 18.36,11.25 18.36,11.74 v1(18.16,11.94) 17.32,11.1 17.32,10.31 16.5,9.49 16.5,8.47 16.57,8.4 16.57,7.78 USB1.A6 ; v1(14.35,12.07) 14.35,12.35 14.53,12.53 14.35,12.71
  Bottom Layer w0.254: v1(14.35,12.07) 14.35,11.62 14.85,11.12 17.35,11.12 v1(18.16,11.94)
$1N5989: length 14.6
  Top Layer w0.254: v1(12.19,10.41) 10.92,9.14 R19.1 ; v1(16.72,10.54) 16.72,11.14 17.34,11.75 17.34,11.75 17.58,11.98 17.58,12.18 17.92,12.52 18.4,12.52 18.75,12.18 18.75,10.79 18.67,10.72 18.67,7.73 USB1.B5
  Bottom Layer w0.254: v1(12.19,10.41) 12.32,10.54 v1(16.72,10.54)
